# Altium schematic sheet temp_meter_meas_block.SchDoc
size A4
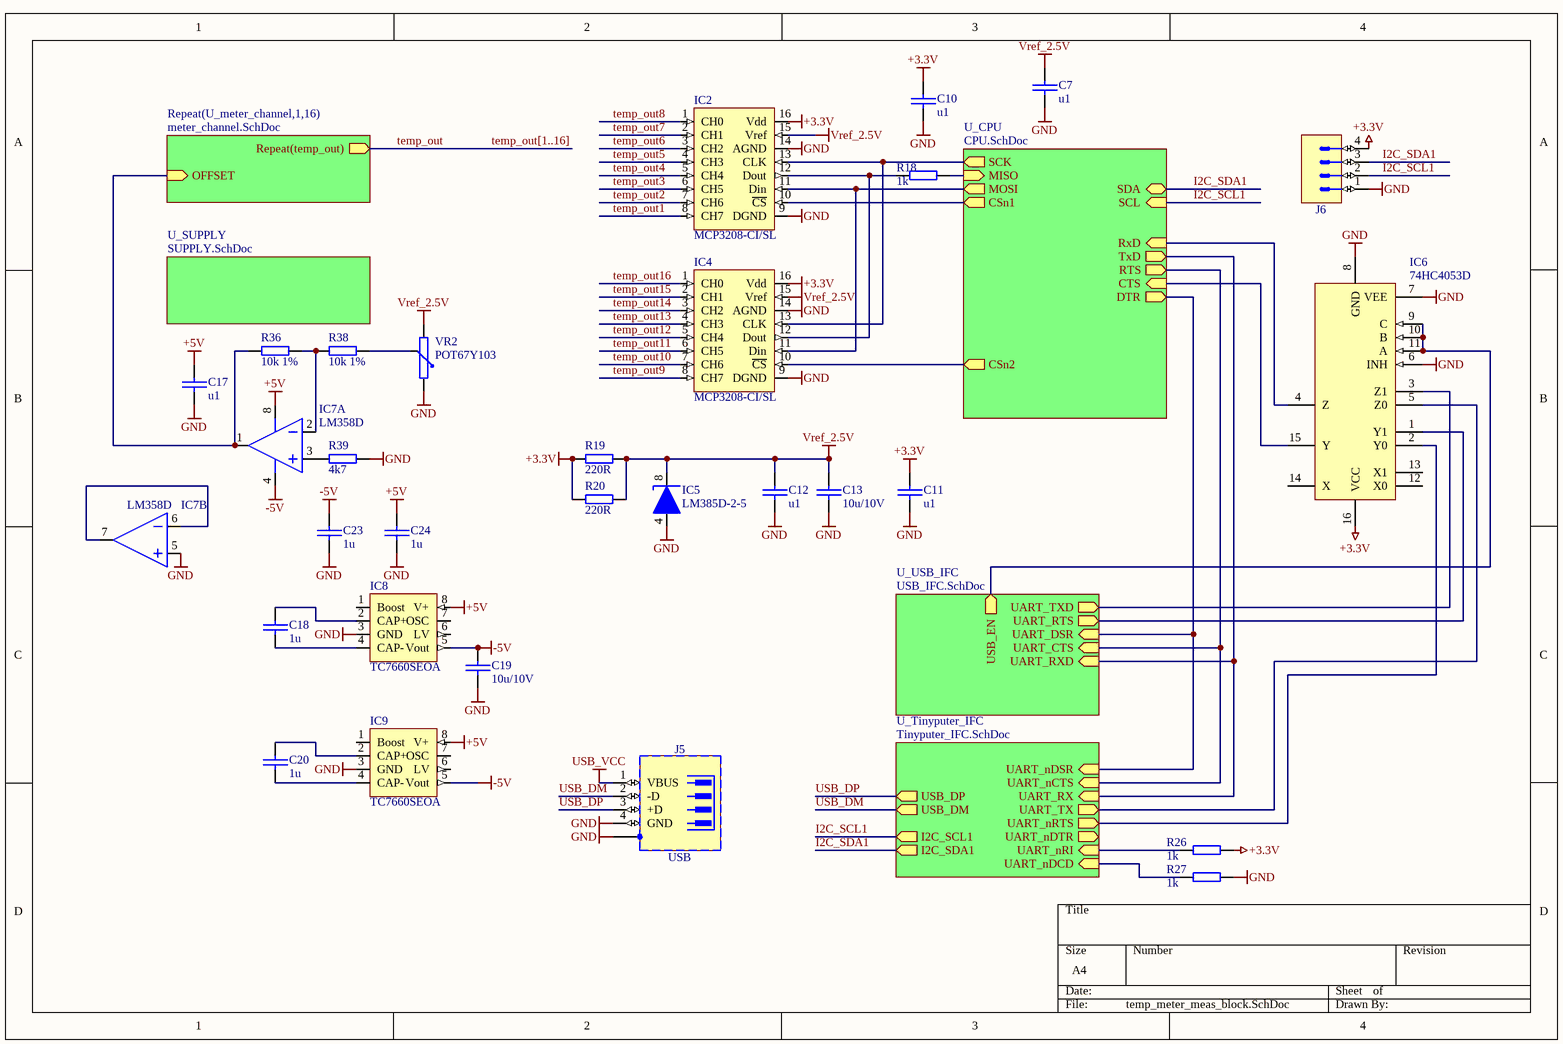
[diagram p0: temp_meter_meas_block.SchDoc]

## Parts
C7  u1  [0402C]
C10  u1  [0603C]
C11  u1  [0603C]
C12  u1  [0603C]
C13  10u/10V  [0805C]
C17  u1  [0603C]
C18  1u  [0603C]
C19  10u/10V  [0805C]
C20  1u  [0603C]
C23  1u  [0603C]
C24  1u  [0603C]
IC2  MCP3208-CI/SL  [SO-16]
IC4  MCP3208-CI/SL  [SO-16]
IC5  LM385D-2-5  [SO-8]
IC6  74HC4053D  [SO-16]
IC7  LM358D  [SO-8]  (parts A,B of 2)
IC8  TC7660SEOA  [SO-8]
IC9  TC7660SEOA  [SO-8]
J5  USB  [FCI_87520-0010BLF]
J6  KK®  [MOLEX_22-27-2041]  (value not drawn)
R18  1k  [0603R]
R19  220R  [0805]
R20  220R  [0805]
R26  1k  [0603R]
R27  1k  [0603R]
R36  10k 1%  [0603R]
R38  10k 1%  [0603R]
R39  4k7  [0603R]
VR2  POT67Y103  [trimpot1]

## Sub-sheets
Repeat(U_meter_channel,1,16) = meter_channel.SchDoc: Repeat(temp_out) (out), OFFSET (in)
U_CPU = CPU.SchDoc: SDA (bidir), SCL (in), CTS (in), RxD (in), TxD (out), RTS (out), DTR (out), SCK (out), MISO (in), MOSI (out), CSn1 (out), CSn2 (out)
U_SUPPLY = SUPPLY.SchDoc: no entries
U_Tinyputer_IFC = Tinyputer_IFC.SchDoc: UART_nCTS (in), UART_nDSR (in), UART_RX (in), UART_nRTS (out), UART_nDTR (out), UART_TX (out), UART_nDCD (in), UART_nRI (in), USB_DP (out), USB_DM (out), I2C_SCL1 (out), I2C_SDA1 (out)
U_USB_IFC = USB_IFC.SchDoc: UART_TXD (out), UART_RXD (in), UART_RTS (out), UART_CTS (in), UART_DSR (in), USB_EN (out)

## Nets
+3.3V: C10.1 C11.1 IC2.16(Vdd) IC4.16(Vdd) IC6.16(VCC) J6.4 R19.2 R20.2 R26.2
+5V: C17.1 C24.1 IC7.8(V+) IC8.8(V+) IC9.8(V+)
-5V: C19.1 C23.1 IC7.4(V-) IC8.5(Vout) IC9.5(Vout)
GND: C7.2 C10.2 C11.2 C12.2 C13.2 C17.2 C19.2 C23.2 C24.2 IC2.9(DGND) IC2.14(AGND) IC4.9(DGND) IC4.14(AGND) IC5.4(A) IC6.6(INH) IC6.7(VEE) IC6.8(GND) IC7.5(IN+) IC8.3(GND) IC9.3(GND) J5.4(GND) J5.5(SH) J6.1 R27.2 R39.2 VR2.3(U)
USB_VCC: J5.1(VBUS)
Vref_2.5V: C7.1 C12.1 C13.1 IC2.15(Vref) IC4.15(Vref) IC5.8(C) R19.1 R20.1 VR2.1(D)
I2C_SCL1: J6.2 ; sheet U_CPU/SCL, sheet U_Tinyputer_IFC/I2C_SCL1
I2C_SDA1: J6.3 ; sheet U_CPU/SDA, sheet U_Tinyputer_IFC/I2C_SDA1
temp_out: sheet Repeat(U_meter_channel,1,16)/Repeat(temp_out)
temp_out1: IC2.8(CH7)
temp_out2: IC2.7(CH6)
temp_out3: IC2.6(CH5)
temp_out4: IC2.5(CH4)
temp_out5: IC2.4(CH3)
temp_out6: IC2.3(CH2)
temp_out7: IC2.2(CH1)
temp_out8: IC2.1(CH0)
temp_out9: IC4.8(CH7)
temp_out10: IC4.7(CH6)
temp_out11: IC4.6(CH5)
temp_out12: IC4.5(CH4)
temp_out13: IC4.4(CH3)
temp_out14: IC4.3(CH2)
temp_out15: IC4.2(CH1)
temp_out16: IC4.1(CH0)
USB_DM: J5.2(-D) ; sheet U_Tinyputer_IFC/USB_DM
USB_DP: J5.3(+D) ; sheet U_Tinyputer_IFC/USB_DP
NetC18_1: C18.1 IC8.2(CAP+)
NetC18_2: C18.2 IC8.4(CAP-)
NetC20_1: C20.1 IC9.2(CAP+)
NetC20_2: C20.2 IC9.4(CAP-)
NetIC2_10: IC2.10(~{CS}) ; sheet U_CPU/CSn1
NetIC2_11: IC2.11(Din) IC4.11(Din) ; sheet U_CPU/MOSI
NetIC2_12: IC2.12(Dout) IC4.12(Dout) R18.1
NetIC2_13: IC2.13(CLK) IC4.13(CLK) ; sheet U_CPU/SCK
NetIC4_10: IC4.10(~{CS}) ; sheet U_CPU/CSn2
NetIC6_1: IC6.1(Y1) ; sheet U_USB_IFC/UART_RTS
NetIC6_2: IC6.2(Y0) ; sheet U_Tinyputer_IFC/UART_nRTS
NetIC6_3: IC6.3(Z1) ; sheet U_USB_IFC/UART_TXD
NetIC6_4: IC6.4(Z) ; sheet U_CPU/RxD
NetIC6_5: IC6.5(Z0) ; sheet U_Tinyputer_IFC/UART_TX
NetIC6_9: IC6.9(C) IC6.10(B) IC6.11(A) ; sheet U_USB_IFC/USB_EN
NetIC6_15: IC6.15(Y) ; sheet U_CPU/CTS
NetIC7_1: IC7.1(OUT) R36.1 ; sheet Repeat(U_meter_channel,1,16)/OFFSET
NetIC7_2: IC7.2(IN-) R36.2 R38.1
NetIC7_3: IC7.3(IN+) R39.1
NetIC7_6: IC7.6(IN-) IC7.7(OUT)
NetR18_2: R18.2 ; sheet U_CPU/MISO
NetR26_1: R26.1 ; sheet U_Tinyputer_IFC/UART_nRI
NetR27_1: R27.1 ; sheet U_Tinyputer_IFC/UART_nDCD
NetR38_2: R38.2 VR2.2(W)
(unnamed): sheet U_CPU/TxD, sheet U_USB_IFC/UART_RXD, sheet U_Tinyputer_IFC/UART_RX
(unnamed): sheet U_CPU/RTS, sheet U_USB_IFC/UART_CTS, sheet U_Tinyputer_IFC/UART_nCTS
(unnamed): sheet U_CPU/DTR, sheet U_USB_IFC/UART_DSR, sheet U_Tinyputer_IFC/UART_nDSR

Not connected (* = marked no-connect by the designer): IC6 12(X0) 13(X1) 14(X); IC8 1(Boost) 6(LV) 7(OSC); IC9 1(Boost) 6(LV) 7(OSC)

## Buses and harness runs
bus temp_out[1..16]

## Library data of the parts
C7 C10-C12 C17 C18 C20 C23 C24 = CAP_SMD_0402: Capacitor SMD
C13 C19 = CAP_SMD_0805: Capacitor SMD
IC2 IC4 = ADC_MCP3208: 8-Channel 12-Bit A/D with SPI
IC5 = REF_LM285/385: 1.2V micropower voltage reference
IC6 = 4053
IC7 = OA_LM358: Operational Amplifier
IC8 IC9 = PWM_TC7660: 20mA PUMP DC-TO-DC VOLTAGE CONVERTER
J5 = FCI_87520-0010BLF: 4 Pin + 1 Shield USB Receptacle; Part Description: USB 2.0 Type A Receptacle, 4 Pins, Right Angle, Shielded; Manufacturer: FCI; Part Number: FCI_87520-0010BLF; Component Kind: Standard; Component Type: Standard; Pin Count: 6; Family: USB; Mounted: Yes; Socket: No; SMD: No; Status: None; Manufacturer Part Number: 87520-0010BLF; ComponentHeight: 7.7mm; HelpURL: \\cern.ch\dfs\Applications\Altium\Datasheets\FCI_87520-0010BLF.pdf; Author: CERN DEM JMW; CreateDate: 2008-10-06; LatestRevisionDate: 2008-10-06; Table: FCI
J6 = MOLEX_22-27-2041: Connector 4 Male; Part Description: 2.54mm (.100") Pitch KK® Wire-to-Board Header, Vertical, with Friction Lock, 4 Circuits, Tin (Sn) Plating; Manufacturer: MOLEX; Part Number: MOLEX_22-27-2041; Component Kind: Standard; Component Type: Standard; Pin Count: 4; Family: KK®; Mounted: Yes; Socket: No; SMD: No; Manufacturer Part Number: 22-27-2041; ComponentHeight: 11.7mm; HelpURL: \\cern.ch\dfs\Applications\Altium\Datasheets\MOLEX_22-27-2041.pdf; Author: CERN DEM JLC; CreateDate: 2008-12-04; LatestRevisionDate: 2008-12-04; Table: MOLEX
R18 R26 R27 R36 R38 R39 = RES_0603: SMD Resistor
R19 R20 = RES2: Resistor
VR2 = TRIMPOT_PREC_9mm_Y: Precision trimpot, 0.5W, +/- 10%